# EAGLE design battery_sensor (EAGLE 5.06)
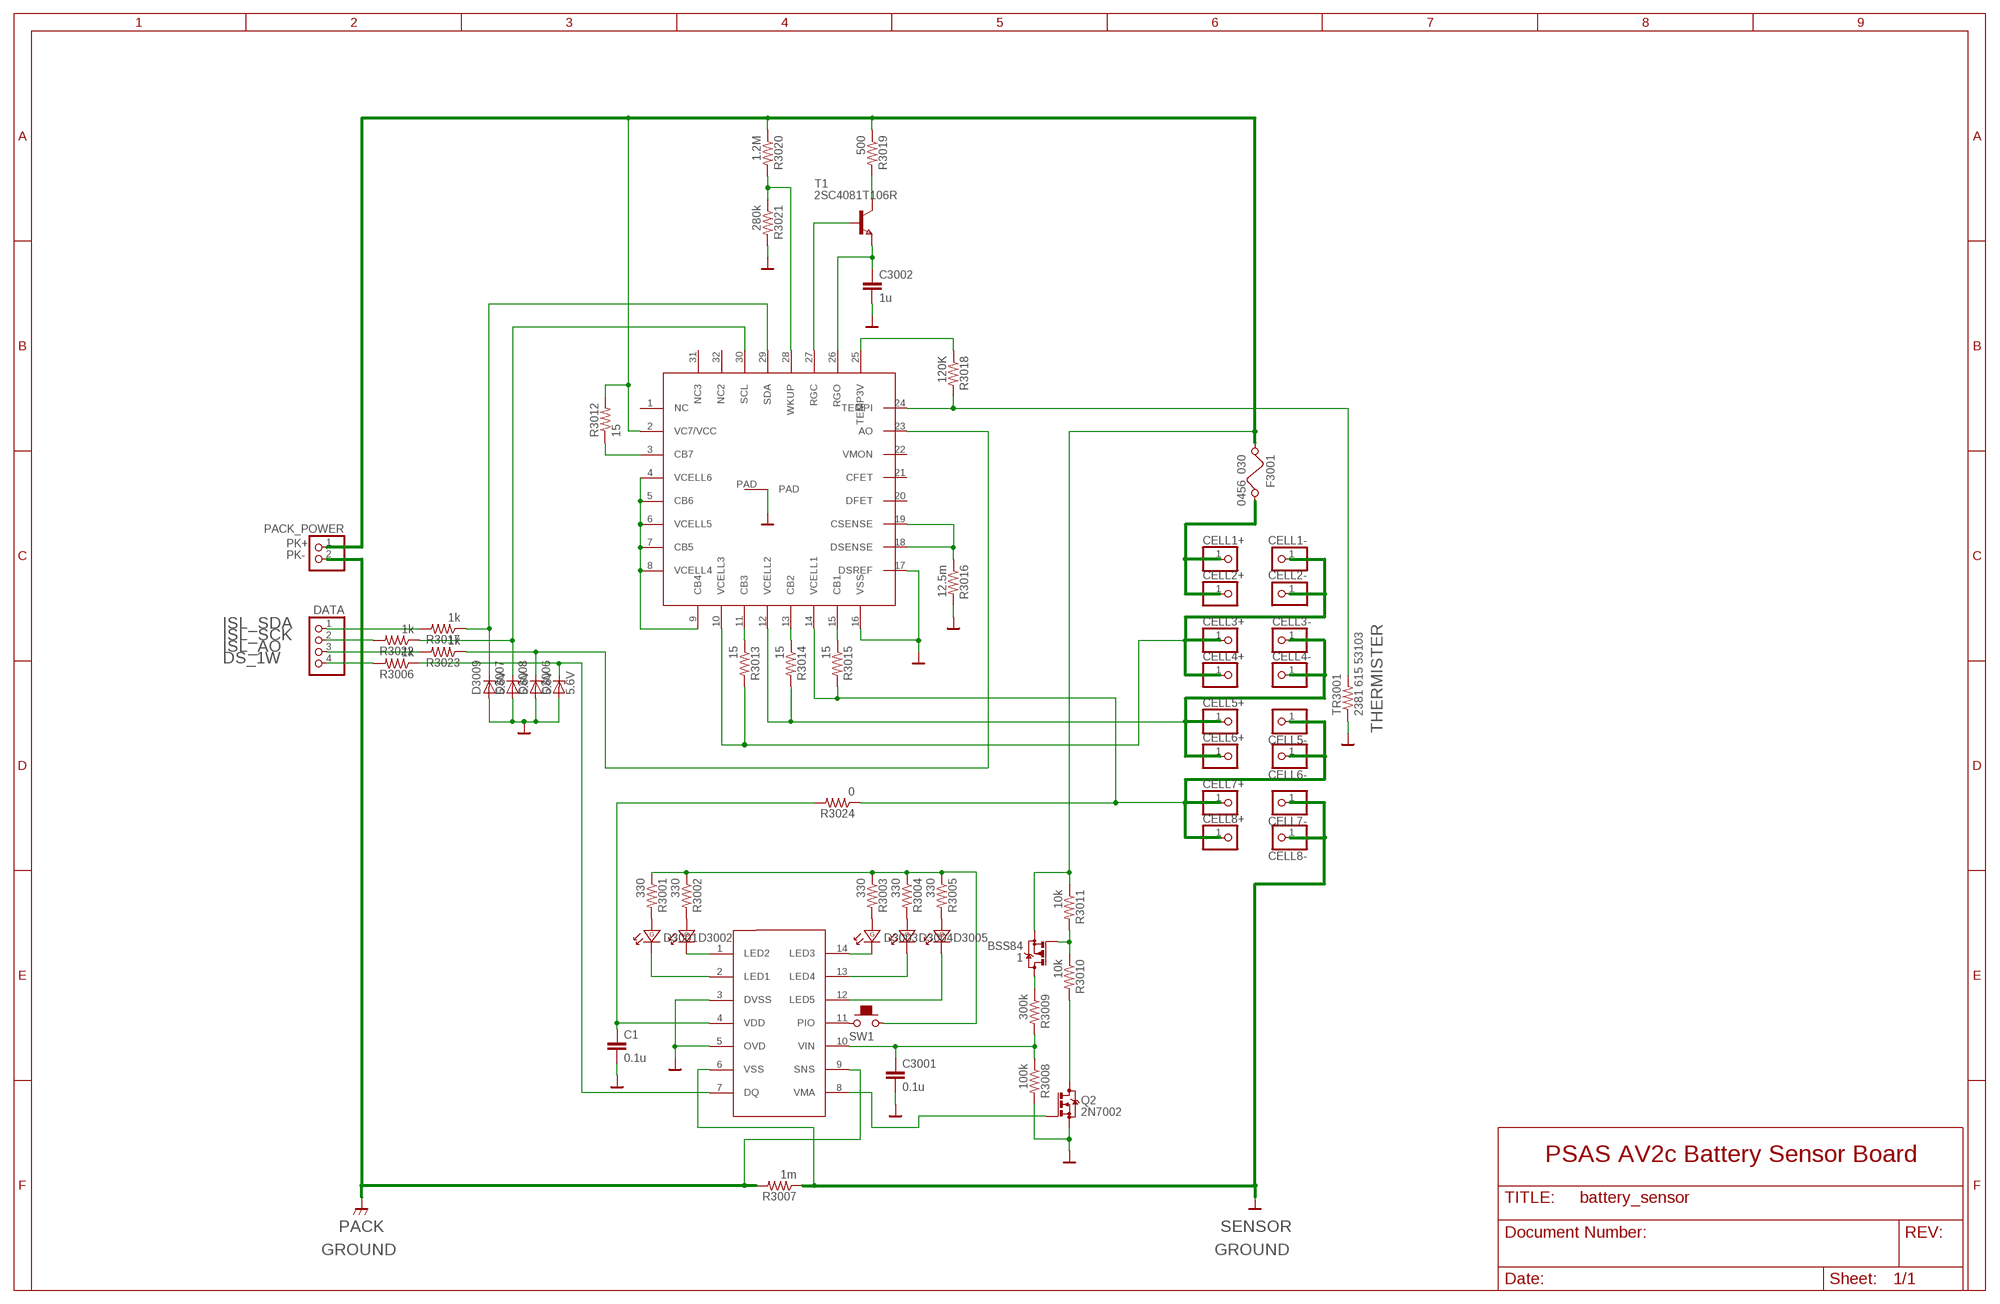
[diagram p0: schematic, sheet 1]

## Parts
1  BSS84  FET_P-CHNL  [SOT23-3]
C1  0.1u  C-EUC0805  [C0805]
C3001  0.1u  C-EUC0805  [C0805]
C3002  1u  C-EUC0805  [C0805]
CELL1+  PINHD-1X1  [1X01]
CELL1-  PINHD-1X1  [1X01]
CELL2+  PINHD-1X1  [1X01]
CELL2-  PINHD-1X1  [1X01]
CELL3+  PINHD-1X1  [1X01]
CELL3-  PINHD-1X1  [1X01]
CELL4+  PINHD-1X1  [1X01]
CELL4-  PINHD-1X1  [1X01]
CELL5+  PINHD-1X1  [1X01]
CELL5-  PINHD-1X1  [1X01]
CELL6+  PINHD-1X1  [1X01]
CELL6-  PINHD-1X1  [1X01]
CELL7+  PINHD-1X1  [1X01]
CELL7-  PINHD-1X1  [1X01]
CELL8+  PINHD-1X1  [1X01]
CELL8-  PINHD-1X1  [1X01]
D3001  LED-GRN-0805  [0805-DIODE]
D3002  LED-GRN-0805  [0805-DIODE]
D3003  LED-GRN-0805  [0805-DIODE]
D3004  LED-GRN-0805  [0805-DIODE]
D3005  LED-GRN-0805  [0805-DIODE]
D3006  5.6V  BZX84CSMD  [TO236]
D3007  5.6V  BZX84CSMD  [TO236]
D3008  5.6V  BZX84CSMD  [TO236]
D3009  5.6V  BZX84CSMD  [TO236]
DATA  PINHD-1X4  [1X04]
F3001  0456 030  FUSE1206  [1206]
PACK_POWER  PINHD-1X2  [1X02]
Q2  2N7002  FET_N-CHNLSOT223  [SOT223]
R3001  330  R-US_R0805  [R0805]
R3002  330  R-US_R0805  [R0805]
R3003  330  R-US_R0805  [R0805]
R3004  330  R-US_R0805  [R0805]
R3005  330  R-US_R0805  [R0805]
R3006  1k  R-US_R0805  [R0805]
R3007  1m  R-US_R0805  [R0805]
R3008  100k  R-US_R0805  [R0805]
R3009  300k  R-US_R0805  [R0805]
R3010  10k  R-US_R0805  [R0805]
R3011  10k  R-US_R0805  [R0805]
R3012  15  R-US_R0805  [R0805]
R3013  15  R-US_R0805  [R0805]
R3014  15  R-US_R0805  [R0805]
R3015  15  R-US_R0805  [R0805]
R3016  12.5m  R-US_R0805  [R0805]
R3017  1k  R-US_R0805  [R0805]
R3018  120K  R-US_R0805  [R0805]
R3019  500  R-US_R0805  [R0805]
R3020  1.2M  R-US_R0805  [R0805]
R3021  280k  R-US_R0805  [R0805]
R3022  1k  R-US_R0805  [R0805]
R3023  1k  R-US_R0805  [R0805]
R3024  0  R-US_R0805  [R0805]
SW1  SW_MOMENTARY-6X3.5MM  [SW_6X3.5MM]
T1  2SC4081T106R  NPNSOT323  [SOT323]
TR3001  2381 615 53103  R-US_R0805  [R0805]
U1  DS2788  [TSSOP14]
U2  ISL9208IRZ  [QFN32-5X5]

## Nets
BAR_GND: C1.2 C3001.2 C3002.2 CELL7-.1 CELL8-.1 D3006.A D3007.A D3008.A D3009.A Q2.3(S) R3007.1 R3008.2 R3016.2 R3021.2 TR3001.1 U1.3(DVSS) U1.5(OVD) U1.6(VSS) U2.16(U:VSS) U2.17(U:DSREF) ; supply symbol labelled SUP_GND_BAR
CELL4: CELL5-.1 CELL6-.1 CELL7+.1 CELL8+.1 R3015.2 R3024.1 U2.14(U:VCELL1)
CELL_VOLTAGE: D3008.C R3023.1 U2.23(U:AO)
DS_1W: DATA.4 R3006.2
I2C_CL: D3007.C R3022.1 U2.30(U:SCL)
I2C_DATA: D3009.C R3017.1 U2.29(U:SDA)
ISL_AO: DATA.3 R3023.2
ISL_SCK: DATA.2 R3022.2
ISL_SDA: DATA.1 R3017.2
N30: CELL1-.1 CELL2-.1 CELL3+.1 CELL4+.1 R3013.2 U2.10(U:VCELL3)
N$1: D3001.1(ANODE)(ANODE) R3001.2
N$2: CELL3-.1 CELL4-.1 CELL5+.1 CELL6+.1 R3014.2 U2.12(U:VCELL2)
N$3: D3002.1(ANODE)(ANODE) R3002.2
N$4: R3015.1 U2.15(U:CB1)
N$5: D3003.1(ANODE)(ANODE) R3003.2
N$7: R3014.1 U2.13(U:CB2)
N$8: D3004.1(ANODE)(ANODE) R3004.2
N$9: D3005.1(ANODE)(ANODE) R3005.2
N$11: D3002.2(CATHODE)(CATHODE) U1.1(LED2)
N$12: D3001.2(CATHODE)(CATHODE) U1.2(LED1)
N$13: D3003.2(CATHODE)(CATHODE) U1.14(LED3)
N$14: D3004.2(CATHODE)(CATHODE) U1.13(LED4)
N$15: D3005.2(CATHODE)(CATHODE) U1.12(LED5)
N$16: R3001.1 R3002.1 R3003.1 R3004.1 R3005.1 SW1.2
N$17: D3006.C R3006.1 U1.7(DQ)
N$18: C3002.1 T1.3(E) U2.26(U:RGO)
N$19: R3020.2 R3021.1 U2.28(U:WKUP)
N$20: C3001.1 R3008.1 R3009.2 U1.10(VIN)
N$21: Q2.1(G) U1.8(VMA)
N$22: 1.3(D) R3009.1
N$25: C1.1 R3024.2 U1.4(VDD)
N$26: R3013.1 U2.11(U:CB3)
N$27: R3012.1 U2.3(U:CB7)
N$28: 1.1(G) R3010.1 R3011.2
N$29: CELL1+.1 CELL2+.1 F3001.2
N$30: U2.4(U:VCELL6) U2.5(U:CB6) U2.6(U:VCELL5) U2.7(U:CB5) U2.8(U:VCELL4) U2.9(U:CB4)
N$32: R3018.1 U2.25(U:TEMP3V)
N$33: R3018.2 TR3001.2 U2.24(U:TEMPI)
N$36: T1.2(B) U2.27(U:RGC)
N$39: R3019.2 T1.1(C)
N$40: SW1.1 U1.11(PIO)
N$41: Q2.4(D) R3010.2
N$43: R3016.1 U2.18(U:DSENSE) U2.19(U:CSENSE)
PK+: 1.2(S) F3001.1 PACK_POWER.1 R3011.1 R3012.2 R3019.1 R3020.1 U2.2(U:VC7/VCC)
PK-: PACK_POWER.2 R3007.2 U1.9(SNS)
Unconnected: U2.1(U:NC) U2.20(U:DFET) U2.21(U:CFET) U2.22(U:VMON) U2.31(U:NC3) U2.32(U:NC2) U2.PAD(PAD:PAD)

## Notes on the sheet
- THERMISTER
- PSAS AV2c Battery Sensor Board
- PACK | SENSOR
- GROUND | GROUND

## Library data of the parts
1 = psas_eagle_library:FET_P-CHNL: Generic P-Channel MOSFET
C1 C3001 C3002 = rcl:C-EU: CAPACITOR, European symbol
CELL1+ CELL1- CELL2+ CELL2- CELL3+ CELL3- CELL4+ CELL4- CELL5+ CELL5- CELL6+ CELL6- CELL7+ CELL7- CELL8+ CELL8- = pinhead:PINHD-1X1: PIN HEADER
D3001-D3005 = psas_eagle_library:LED-GRN-?
D3006-D3009 = diode:BZX84CSMD: Z DIODE
DATA = pinhead:PINHD-1X4: PIN HEADER
F3001 = psas_eagle_library:FUSE: Fuse
PACK_POWER = pinhead:PINHD-1X2: PIN HEADER
Q2 = psas_eagle_library:FET_N-CHNL: Generic N-Channel MOSFET
R3001-R3024 TR3001 = rcl:R-US_: RESISTOR, American symbol
SW1 = psas_eagle_library-1.9:SW_MOMENTARY: Momentary push button
T1 = zetex:NPNSOT323: NPN TRANSISTOR
U1 = DS2788:DS2788: MAXIM stand-alone Fuel-Gauge IC with LED Display Drivers Package: 14 TSSOP
U2 = ISL9208:ISL9208: ISL9208 with Li-Ion Battery Pack analog front end

## Board
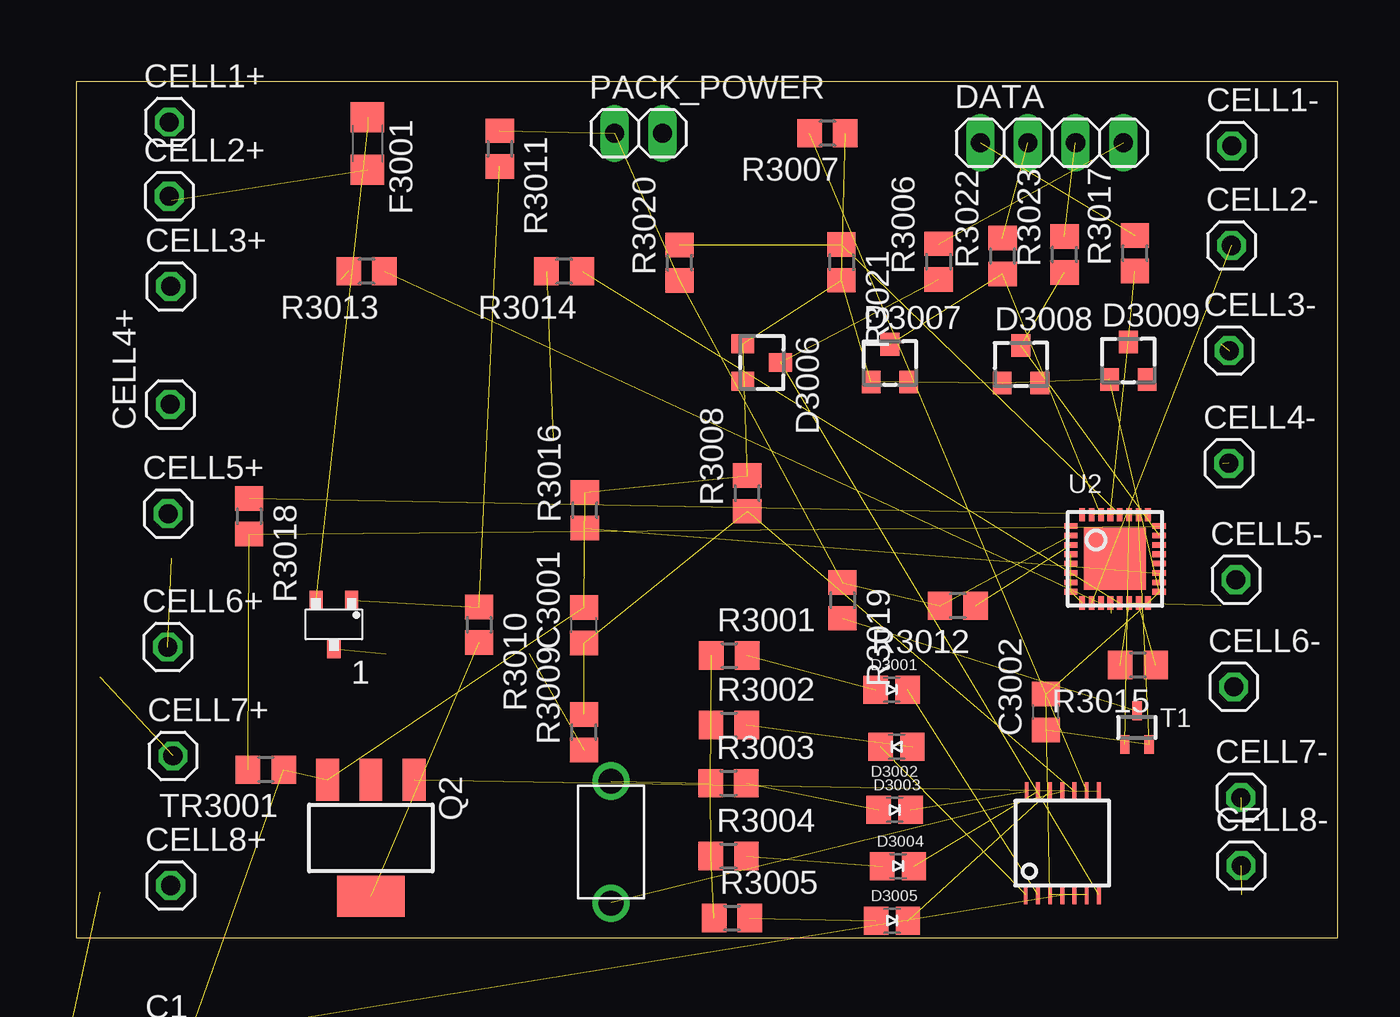
[diagram p1: board, top side]
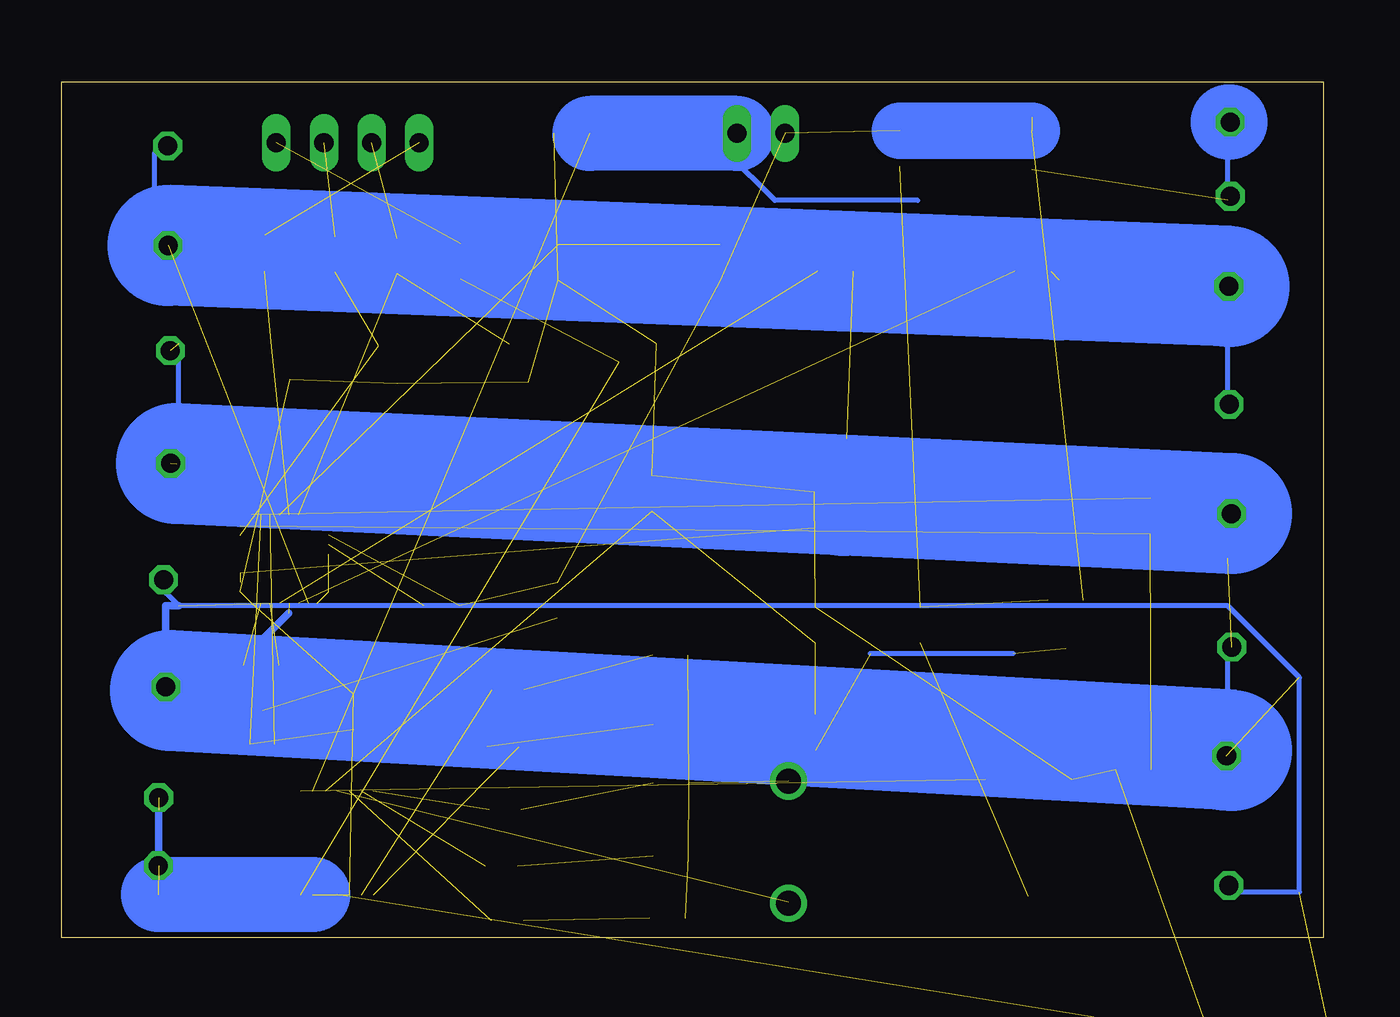
[diagram p2: board, bottom side, seen from below]

Size 67.2 x 45.6 mm. Coordinates in mm from the lower left corner, seen from the top.
Outline: 67.2,45.6 0,45.6 0,0 67.2,0 67.2,45.6
Copper layers (1*16): Top 0.035mm / dielectric 1.5mm / Bottom 0.035mm
Design rules "default": minimum track width 10mil, minimum drill 24mil, track to track 8mil, track to pad 8mil, pad to pad 8mil, via to via 8mil, smd to smd 8mil, copper to edge 40mil, drill to drill 8mil, minimum pad ring 10mil, minimum via ring 8mil, stop-mask expansion 4mil, vias tented up to drill 0mil, thermal gap 10mil

### Footprints (pad centres in the part's own frame; a part is rotated, then mirrored left to right if it is on the bottom)
SOT23-3 = smd 0.7 x 1: 1 -0.95,-1.3; 2 0.95,-1.3; 3 0,1.3
C0805 = smd 1.3 x 1.5: 1 -0.95,0; 2 0.95,0
1X01 = drill 1.016 octagon: 1 0,0
0805-DIODE = smd 1.3 x 1.5: 1(ANODE) -0.85,0; 2(CATHODE) 0.85,0
TO236 = smd 1 x 1.2: A -1,-1; C 0,1; NC 1,-1
1X04 = drill 1.016 long: 1 -3.81,0; 2 -1.27,0; 3 1.27,0; 4 3.81,0
1206 = smd 1.6 x 1.8: 1 -1.4,0; 2 1.4,0
1X02 = drill 1.016 long: 1 -1.27,0; 2 1.27,0
SOT223 = smd 1.219 x 2.235: 1 -2.311,-3.099; 2 0,-3.099; 3 2.311,-3.099 | smd 3.6 x 2.2: 4 0,3.099
R0805 = smd 1.3 x 1.5: 1 -0.95,0; 2 0.95,0
SW_6X3.5MM = drill 1.321 round: 1 -3.25,0; 2 3.25,0
SOT323 = smd 0.5 x 1: 1 0,0.9; 2 -0.65,-0.9; 3 0.65,-0.9
TSSOP14 = smd 0.2 x 1: 1 -1.95,-2.75; 2 -1.3,-2.75; 3 -0.65,-2.75; 4 0,-2.75; 5 0.65,-2.75; 6 1.3,-2.75; 7 1.95,-2.75; 8 1.95,2.75; 9 1.3,2.75; 10 0.65,2.75; 11 0,2.75; 12 -0.65,2.75; 13 -1.3,2.75; 14 -1.9,2.75
QFN32-5X5 = smd 0.7 x 0.3: 1 -2.35,1.75; 2 -2.35,1.25; 3 -2.35,0.75; 4 -2.35,0.25; 5 -2.35,-0.25; 6 -2.35,-0.75; 7 -2.35,-1.25; 8 -2.35,-1.75; 17 2.35,-1.75; 18 2.35,-1.25; 19 2.35,-0.75; 20 2.35,-0.25; 21 2.35,0.25; 22 2.35,0.75; 23 2.35,1.25; 24 2.35,1.75 | smd 0.3 x 0.7: 9 -1.75,-2.35; 10 -1.25,-2.35; 11 -0.75,-2.35; 12 -0.25,-2.35; 13 0.25,-2.35; 14 0.75,-2.35; 15 1.25,-2.35; 16 1.75,-2.35; 25 1.75,2.35; 26 1.25,2.35; 27 0.75,2.35; 28 0.25,2.35; 29 -0.25,2.35; 30 -0.75,2.35; 31 -1.25,2.35; 32 -1.75,2.35 | smd 3.3 x 3.3: PAD 0,0

### Placement (x,y rotation side)
1  13.72,16.69 180 top
C1  4.95,-5.56 0 top  (outside the outline)
C3001  27.04,16.65 90 top
C3002  51.64,12.03 90 top
CELL1+  4.96,43.44 0 top
CELL1-  61.55,42.17 0 top
CELL2+  4.95,39.49 0 top
CELL2-  61.53,36.87 0 top
CELL3+  5.03,34.69 0 top
CELL3-  61.41,31.27 0 top
CELL4+  5.01,28.41 90 top
CELL4-  61.39,25.27 0 top
CELL5+  4.89,22.59 0 top
CELL5-  61.77,19.07 0 top
CELL6+  4.87,15.49 0 top
CELL6-  61.65,13.37 0 top
CELL7+  5.15,9.69 0 top
CELL7-  62.03,7.47 0 top
CELL8+  5.03,2.79 0 top
CELL8-  62.05,3.85 0 top
D3001  43.43,13.22 0 top
D3002  43.69,10.18 180 top
D3003  43.59,6.82 0 top
D3004  43.77,3.82 0 top
D3005  43.45,0.92 0 top
D3006  36.51,30.64 270 top
D3007  43.34,30.61 0 top
D3008  50.32,30.54 0 top
D3009  56.04,30.74 0 top
DATA  51.96,42.34 0 top
F3001  15.51,42.3 270 top
PACK_POWER  29.95,42.84 0 top
Q2  15.69,5.32 180 top
R3001  34.78,15.04 0 top
R3002  34.76,11.34 0 top
R3003  34.74,8.24 0 top
R3004  34.75,4.36 0 top
R3005  34.93,1.06 0 top
R3006  45.94,36.01 90 top
R3007  40.01,42.84 180 top
R3008  35.74,23.67 90 top
R3009  27.04,10.95 90 top
R3010  21.46,16.67 270 top
R3011  22.56,42.03 270 top
R3012  46.95,17.69 180 top
R3013  15.47,35.49 180 top
R3014  25.99,35.49 180 top
R3015  56.55,14.53 180 top
R3016  27.09,22.77 90 top
R3017  56.39,36.46 90 top
R3018  9.21,22.45 270 top
R3019  40.81,17.97 270 top
R3020  32.14,35.95 90 top
R3021  40.76,35.97 270 top
R3022  49.34,36.31 90 top
R3023  52.64,36.39 90 top
R3024  -0.89,-11.91 0 top  (outside the outline)
SW1  28.48,5.1 90 top
T1  56.5,11.2 0 top
TR3001  10.1,8.96 180 top
U1  52.52,5.05 0 top
U2  55.33,20.18 0 top

### Tracks (layer width: path | path; a pad name or v marks a point on that pad's centre or on a via)
BAR_GND  (20 unrouted)
  Bottom 0.406: 62.03,6.8 62.03,3.85 CELL8-.1
  Bottom 4: U1.6 62.05,2.3
CELL4  (4 unrouted)
  Bottom 0.254: CELL5-.1 62.23,18.95 60.96,17.68 5.08,17.68 1.27,13.87 1.27,2.44 5.08,2.44 CELL8+.1
  Bottom 0.406: 60.96,17.68 61.65,17.68 CELL6-.1
CELL_VOLTAGE  (2 unrouted)
DS_1W  (1 unrouted)
I2C_CL  (2 unrouted)
I2C_DATA  (2 unrouted)
ISL_AO  (1 unrouted)
ISL_SCK  (1 unrouted)
ISL_SDA  (1 unrouted)
N30  (2 unrouted)
  Bottom 0.254: CELL3+.1 5.08,31.65 5.08,29.11 CELL4+.1 | 14.08,35.04 13.97,38 | CELL1-.1 62.23,41.81 62.23,39.27 CELL2-.1
  Bottom 6.452: CELL3+.1 14.08,35.04 CELL2-.1
N$1  (1 unrouted)
N$2  (5 unrouted)
  Bottom 0.254: 4.97,22.59 5.08,20.22 | CELL6+.1 5.08,15.14 5.08,12.6 5.23,10.01 | 25.54,23.57 25.4,26.57 | 60.96,31.65 60.96,27.84 61.08,25.25
  Bottom 0.406: 61.39,13.17 59.23,13.17 55.1,17.3
  Bottom 6.452: CELL5+.1 4.97,22.59 25.54,23.57 61.08,25.25 | 4.89,9.99 5.23,10.01 61.39,13.17
N$3  (1 unrouted)
N$4  (1 unrouted)
N$5  (1 unrouted)
N$7  (1 unrouted)
N$8  (1 unrouted)
N$9  (1 unrouted)
N$11  (1 unrouted)
N$12  (1 unrouted)
N$13  (1 unrouted)
N$14  (1 unrouted)
N$15  (1 unrouted)
N$16  (5 unrouted)
N$17  (2 unrouted)
N$18  (2 unrouted)
N$19  (2 unrouted)
N$20  (3 unrouted)
N$21  (1 unrouted)
N$22  (2 unrouted)
  Bottom 0.254: 16.51,15.14 24.13,15.14
N$25  (2 unrouted)
N$26  (1 unrouted)
N$27  (1 unrouted)
N$28  (2 unrouted)
N$29  (1 unrouted)
  Bottom 0.254: CELL2+.1 5.08,39.27 5.08,43.44
  Bottom 4: 5.08,43.44 CELL1+.1
N$30  (5 unrouted)
N$32  (1 unrouted)
N$33  (2 unrouted)
N$36  (1 unrouted)
N$39  (1 unrouted)
N$40  (1 unrouted)
  Bottom 0.406: SW1.1 28.48,1.9
N$41  (1 unrouted)
N$43  (2 unrouted)
PK+  (8 unrouted)
  Bottom 3: 15.51,42.98 R3011.1
PK-  (2 unrouted)
  Bottom 0.254: 21.59,39.27 29.21,39.27 31.75,41.81 PACK_POWER.2
  Bottom 4: PACK_POWER.2 R3007.2